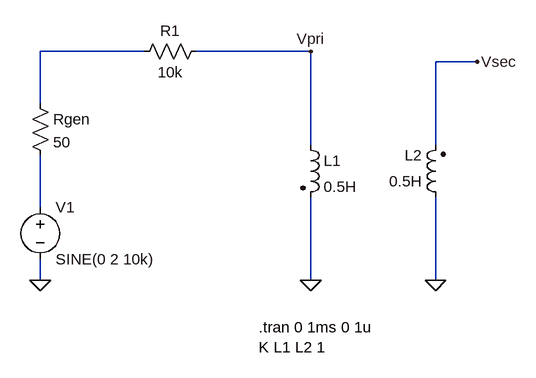
[diagram p0: schematic Coupled_inductors.asc]
Coupled_inductors.asc, the LTspice schematic file:
Version 4
SHEET 1 1032 680
WIRE 240 -112 80 -112
WIRE 496 -112 320 -112
WIRE 752 -96 688 -96
WIRE 80 -32 80 -112
WIRE 496 32 496 -112
WIRE 688 32 688 -96
WIRE 80 128 80 48
WIRE 80 240 80 208
WIRE 496 240 496 112
WIRE 688 240 688 112
FLAG 80 240 0
FLAG 496 240 0
FLAG 688 240 0
FLAG 496 -112 Vpri
FLAG 752 -96 Vsec
SYMBOL voltage 80 112 R0
WINDOW 123 0 0 Left 0
WINDOW 39 0 0 Left 0
SYMATTR InstName V1
SYMATTR Value SINE(0 2 10k)
SYMBOL res 64 -48 R0
SYMATTR InstName Rgen
SYMATTR Value 50
SYMBOL ind2 480 16 R0
SYMATTR InstName L1
SYMATTR Value 0.5H
SYMATTR Type ind
SYMBOL ind2 704 128 R180
WINDOW 0 36 80 Left 2
WINDOW 3 36 40 Left 2
SYMATTR InstName L2
SYMATTR Value 0.5H
SYMATTR Type ind
SYMBOL res 336 -128 R90
WINDOW 0 0 56 VBottom 2
WINDOW 3 32 56 VTop 2
SYMATTR InstName R1
SYMATTR Value 10k
TEXT 416 312 Left 2 !.tran 0 1ms 0 1u\nK L1 L2 1

The netlist it stands for:
* Coupled_inductors.asc
V1 N002 0 SINE(0 2 10k)
Rgen N001 N002 50
L1 Vpri 0 0.5H
L2 0 Vsec 0.5H
R1 Vpri N001 10k
.tran 0 1ms 0 1u
K L1 L2 1
.backanno
.end